# EAGLE design pcb_throughhole (EAGLE 9.6.2)
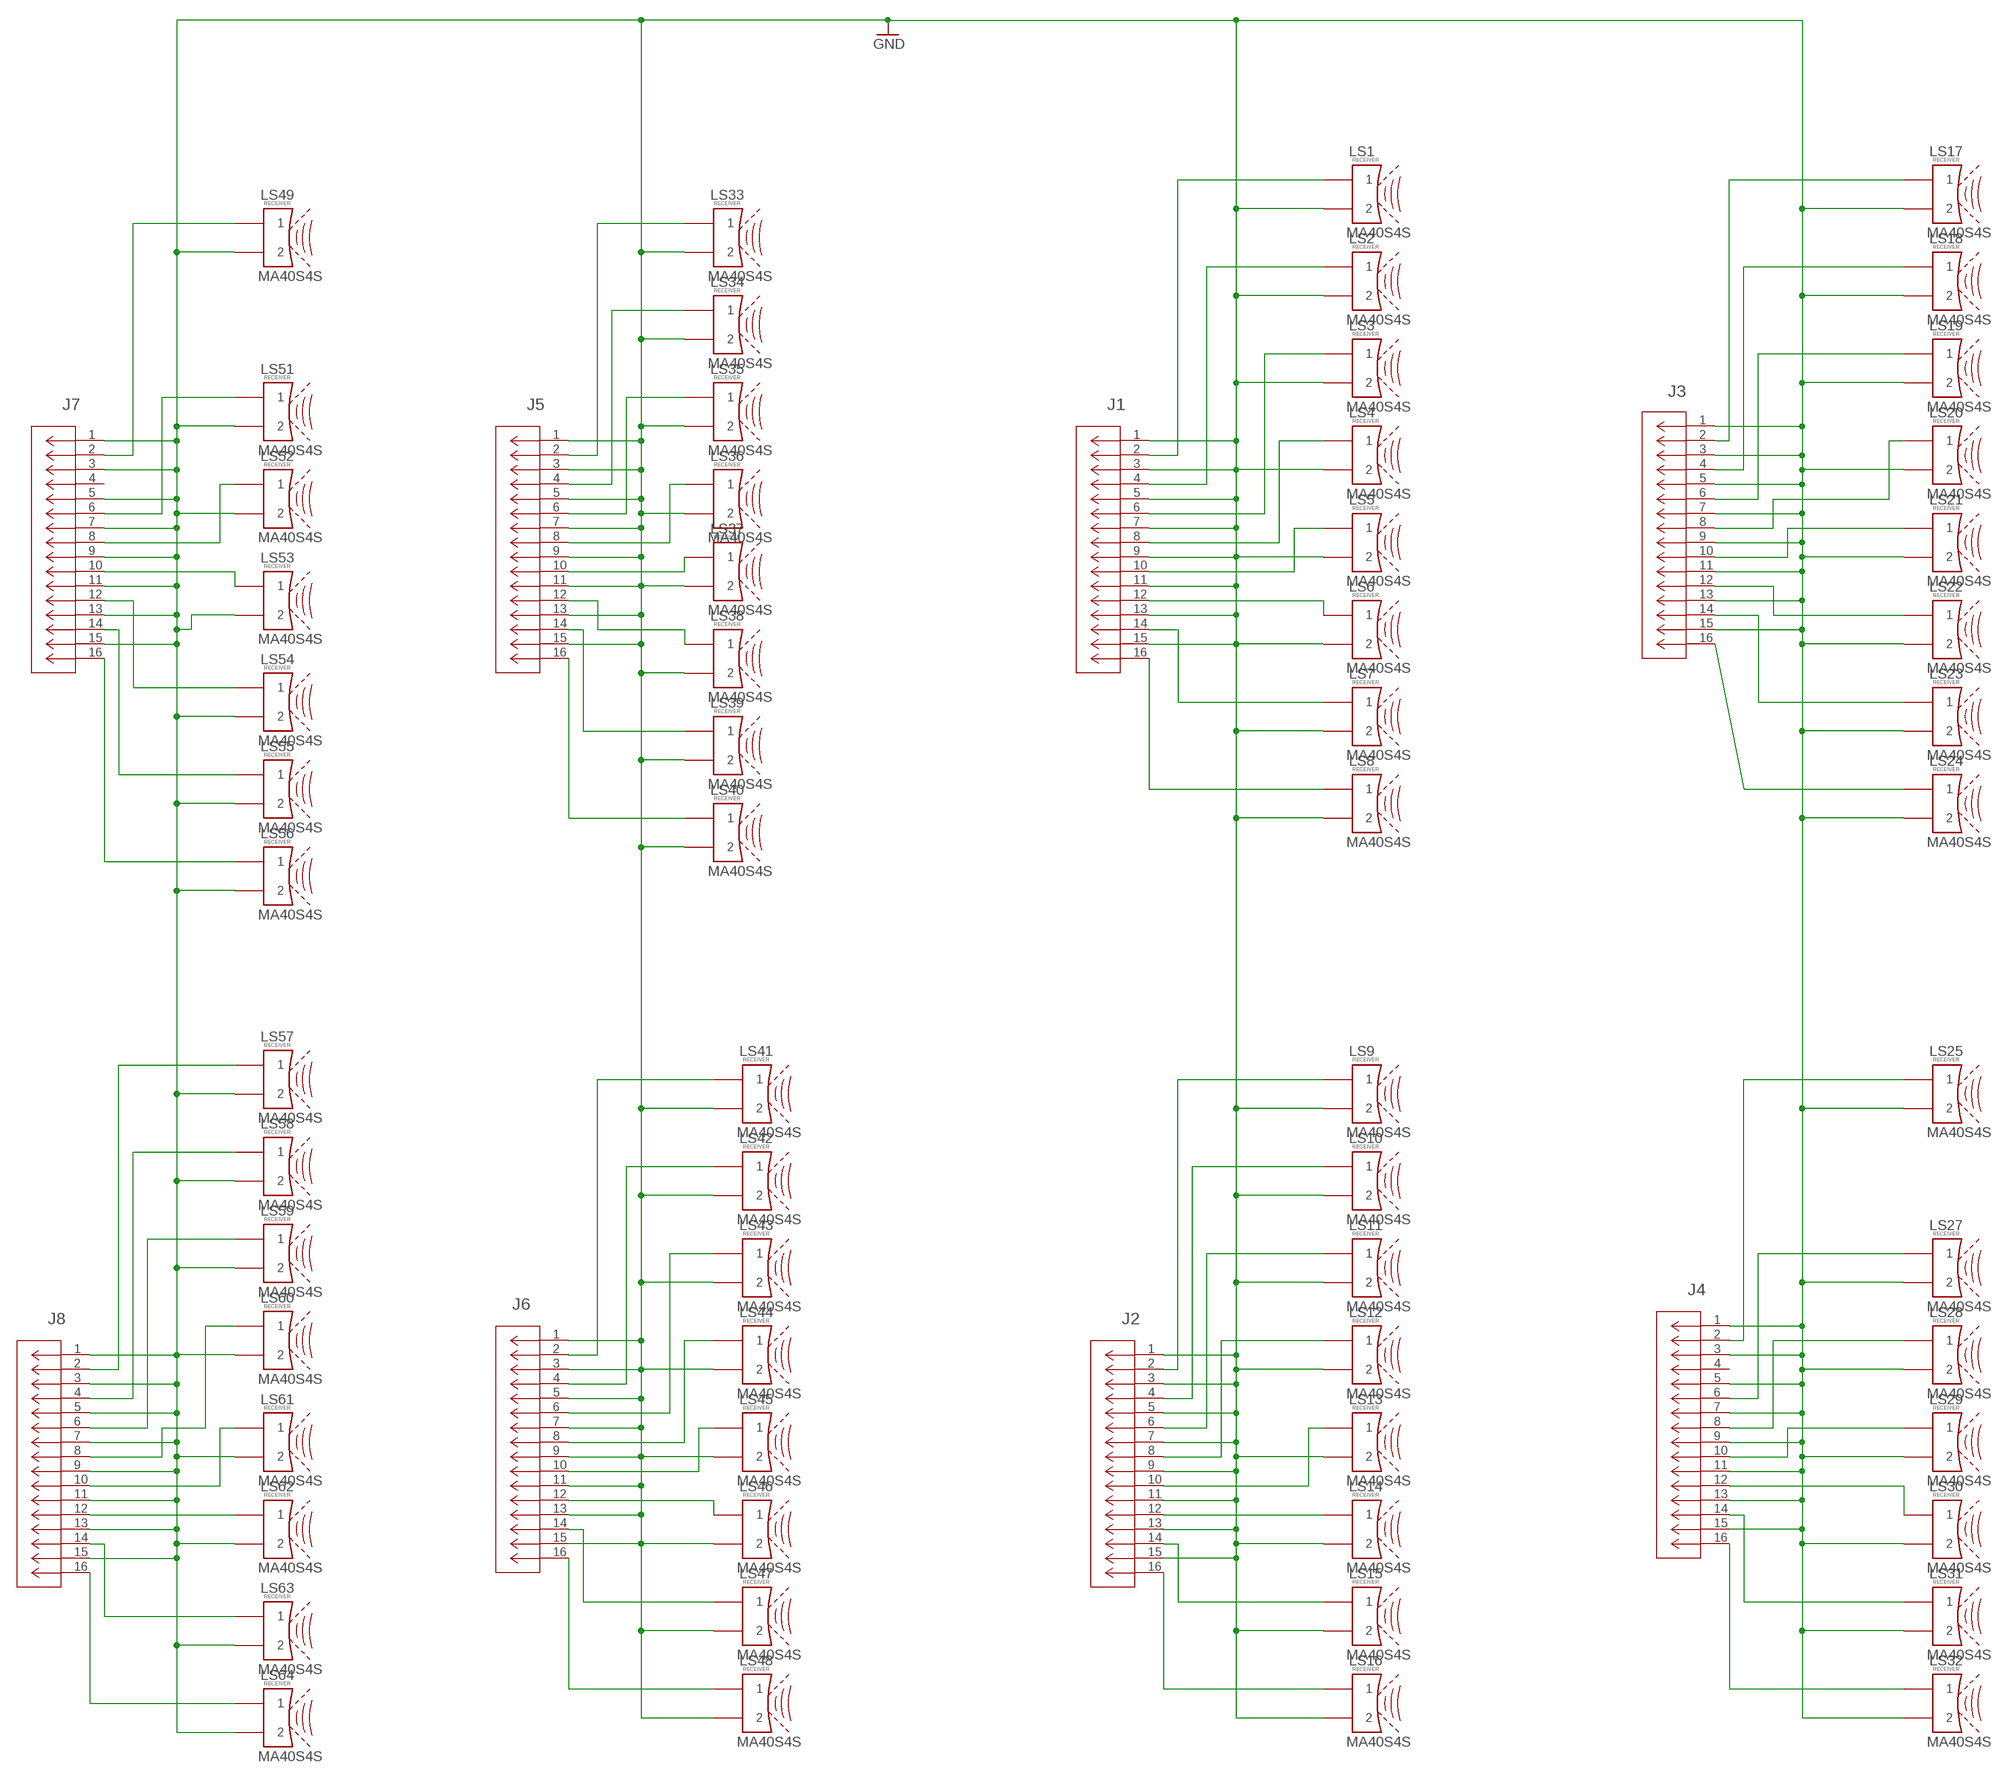
[diagram p0: schematic, sheet 1]

## Parts
J1  70246-1201  [CONN_70246-1201_MOL]
J2  70246-1201  [CONN_70246-1201_MOL]
J3  70246-1201  [CONN_70246-1201_MOL]
J4  70246-1201  [CONN_70246-1201_MOL]
J5  70246-1201  [CONN_70246-1201_MOL]
J6  70246-1201  [CONN_70246-1201_MOL]
J7  70246-1201  [CONN_70246-1201_MOL]
J8  70246-1201  [CONN_70246-1201_MOL]
LS1  MA40S4S  [XDCR_MA40S4S]
LS2  MA40S4S  [XDCR_MA40S4S]
LS3  MA40S4S  [XDCR_MA40S4S]
LS4  MA40S4S  [XDCR_MA40S4S]
LS5  MA40S4S  [XDCR_MA40S4S]
LS6  MA40S4S  [XDCR_MA40S4S]
LS7  MA40S4S  [XDCR_MA40S4S]
LS8  MA40S4S  [XDCR_MA40S4S]
LS9  MA40S4S  [XDCR_MA40S4S]
LS10  MA40S4S  [XDCR_MA40S4S]
LS11  MA40S4S  [XDCR_MA40S4S]
LS12  MA40S4S  [XDCR_MA40S4S]
LS13  MA40S4S  [XDCR_MA40S4S]
LS14  MA40S4S  [XDCR_MA40S4S]
LS15  MA40S4S  [XDCR_MA40S4S]
LS16  MA40S4S  [XDCR_MA40S4S]
LS17  MA40S4S  [XDCR_MA40S4S]
LS18  MA40S4S  [XDCR_MA40S4S]
LS19  MA40S4S  [XDCR_MA40S4S]
LS20  MA40S4S  [XDCR_MA40S4S]
LS21  MA40S4S  [XDCR_MA40S4S]
LS22  MA40S4S  [XDCR_MA40S4S]
LS23  MA40S4S  [XDCR_MA40S4S]
LS24  MA40S4S  [XDCR_MA40S4S]
LS25  MA40S4S  [XDCR_MA40S4S]
LS27  MA40S4S  [XDCR_MA40S4S]
LS28  MA40S4S  [XDCR_MA40S4S]
LS29  MA40S4S  [XDCR_MA40S4S]
LS30  MA40S4S  [XDCR_MA40S4S]
LS31  MA40S4S  [XDCR_MA40S4S]
LS32  MA40S4S  [XDCR_MA40S4S]
LS33  MA40S4S  [XDCR_MA40S4S]
LS34  MA40S4S  [XDCR_MA40S4S]
LS35  MA40S4S  [XDCR_MA40S4S]
LS36  MA40S4S  [XDCR_MA40S4S]
LS37  MA40S4S  [XDCR_MA40S4S]
LS38  MA40S4S  [XDCR_MA40S4S]
LS39  MA40S4S  [XDCR_MA40S4S]
LS40  MA40S4S  [XDCR_MA40S4S]
LS41  MA40S4S  [XDCR_MA40S4S]
LS42  MA40S4S  [XDCR_MA40S4S]
LS43  MA40S4S  [XDCR_MA40S4S]
LS44  MA40S4S  [XDCR_MA40S4S]
LS45  MA40S4S  [XDCR_MA40S4S]
LS46  MA40S4S  [XDCR_MA40S4S]
LS47  MA40S4S  [XDCR_MA40S4S]
LS48  MA40S4S  [XDCR_MA40S4S]
LS49  MA40S4S  [XDCR_MA40S4S]
LS51  MA40S4S  [XDCR_MA40S4S]
LS52  MA40S4S  [XDCR_MA40S4S]
LS53  MA40S4S  [XDCR_MA40S4S]
LS54  MA40S4S  [XDCR_MA40S4S]
LS55  MA40S4S  [XDCR_MA40S4S]
LS56  MA40S4S  [XDCR_MA40S4S]
LS57  MA40S4S  [XDCR_MA40S4S]
LS58  MA40S4S  [XDCR_MA40S4S]
LS59  MA40S4S  [XDCR_MA40S4S]
LS60  MA40S4S  [XDCR_MA40S4S]
LS61  MA40S4S  [XDCR_MA40S4S]
LS62  MA40S4S  [XDCR_MA40S4S]
LS63  MA40S4S  [XDCR_MA40S4S]
LS64  MA40S4S  [XDCR_MA40S4S]

## Nets
GND: J1.1 J1.3 J1.5 J1.7 J1.9 J1.11 J1.13 J1.15 J2.1 J2.3 J2.5 J2.7 J2.9 J2.11 J2.13 J2.15 J3.1 J3.3 J3.5 J3.7 J3.9 J3.11 J3.13 J3.15 J4.1 J4.3 J4.5 J4.7 J4.9 J4.11 J4.13 J4.15 J5.1 J5.3 J5.5 J5.7 J5.9 J5.11 J5.13 J5.15 J6.1 J6.3 J6.5 J6.7 J6.9 J6.11 J6.13 J6.15 J7.1 J7.3 J7.5 J7.7 J7.9 J7.11 J7.13 J7.15 J8.1 J8.3 J8.5 J8.7 J8.9 J8.11 J8.13 J8.15 LS1.2 LS2.2 LS3.2 LS4.2 LS5.2 LS6.2 LS7.2 LS8.2 LS9.2 LS10.2 LS11.2 LS12.2 LS13.2 LS14.2 LS15.2 LS16.2 LS17.2 LS18.2 LS19.2 LS20.2 LS21.2 LS22.2 LS23.2 LS24.2 LS25.2 LS27.2 LS28.2 LS29.2 LS30.2 LS31.2 LS32.2 LS33.2 LS34.2 LS35.2 LS36.2 LS37.2 LS38.2 LS39.2 LS40.2 LS41.2 LS42.2 LS43.2 LS44.2 LS45.2 LS46.2 LS47.2 LS48.2 LS49.2 LS51.2 LS52.2 LS53.2 LS54.2 LS55.2 LS56.2 LS57.2 LS58.2 LS59.2 LS60.2 LS61.2 LS62.2 LS63.2 LS64.2
N$1: J1.16 LS8.1
N$2: J1.14 LS7.1
N$3: J1.12 LS6.1
N$5: J1.10 LS5.1
N$6: J1.8 LS4.1
N$7: J1.6 LS3.1
N$8: J1.4 LS2.1
N$9: J1.2 LS1.1
N$10: J2.16 LS16.1
N$11: J2.14 LS15.1
N$12: J2.12 LS14.1
N$13: J2.10 LS13.1
N$14: J2.8 LS12.1
N$15: J2.6 LS11.1
N$16: J2.4 LS10.1
N$17: J2.2 LS9.1
N$18: J4.16 LS32.1
N$19: J4.14 LS31.1
N$20: J4.12 LS30.1
N$21: J4.10 LS29.1
N$22: J4.8 LS28.1
N$23: J4.6 LS27.1
N$25: J4.2 LS25.1
N$26: J3.16 LS24.1
N$27: J3.14 LS23.1
N$28: J3.12 LS22.1
N$29: J3.10 LS21.1
N$30: J3.8 LS20.1
N$31: J3.6 LS19.1
N$32: J3.4 LS18.1
N$33: J3.2 LS17.1
N$34: J5.16 LS40.1
N$35: J5.14 LS39.1
N$36: J5.12 LS38.1
N$37: J5.10 LS37.1
N$38: J5.8 LS36.1
N$39: J5.6 LS35.1
N$40: J5.4 LS34.1
N$41: J5.2 LS33.1
N$42: J6.16 LS48.1
N$43: J6.14 LS47.1
N$44: J6.12 LS46.1
N$45: J6.10 LS45.1
N$46: J6.8 LS44.1
N$47: J6.6 LS43.1
N$48: J6.4 LS42.1
N$49: J6.2 LS41.1
N$50: J8.16 LS64.1
N$51: J8.14 LS63.1
N$52: J8.12 LS62.1
N$53: J8.10 LS61.1
N$54: J8.8 LS60.1
N$55: J8.6 LS59.1
N$56: J8.4 LS58.1
N$57: J8.2 LS57.1
N$58: J7.16 LS56.1
N$59: J7.14 LS55.1
N$60: J7.12 LS54.1
N$61: J7.10 LS53.1
N$62: J7.8 LS52.1
N$63: J7.6 LS51.1
N$65: J7.2 LS49.1
Unconnected: J4.4 J7.4

## Library data of the parts
J1-J8 = molex_16way:70246-1201; BUILT_BY: EMA_Cory; COPYRIGHT: Copyright (C) 2018 Accelerated Designs. All rights reserved; DATASHEET: https://www.molex.com/pdm_docs/sd/702461602_sd.pdf; MANUFACTURER_PART_NUMBER: 70246-1201; SOURCELIBRARY: Add_to_database_2020-11-05; VENDOR: Molex Connector Corporation
LS1-LS25 LS27-LS49 LS51-LS64 = MA40S4S:MA40S4S: ULTRASONIC SENSOR RCVR 40KHZ Check availability <https://pricing.snapeda.com/parts/MA40S4S/Murata/view-part?ref=eda>; AVAILABILITY: In Stock; DESCRIPTION: ULTRASONIC SENSOR TRANS 40KHZ; MF: Murata; MP: MA40S4S; PACKAGE: Radial-2 Murata; PRICE: None; PURCHASE-URL: https://pricing.snapeda.com/search/part/MA40S4S/?ref=eda

## Board
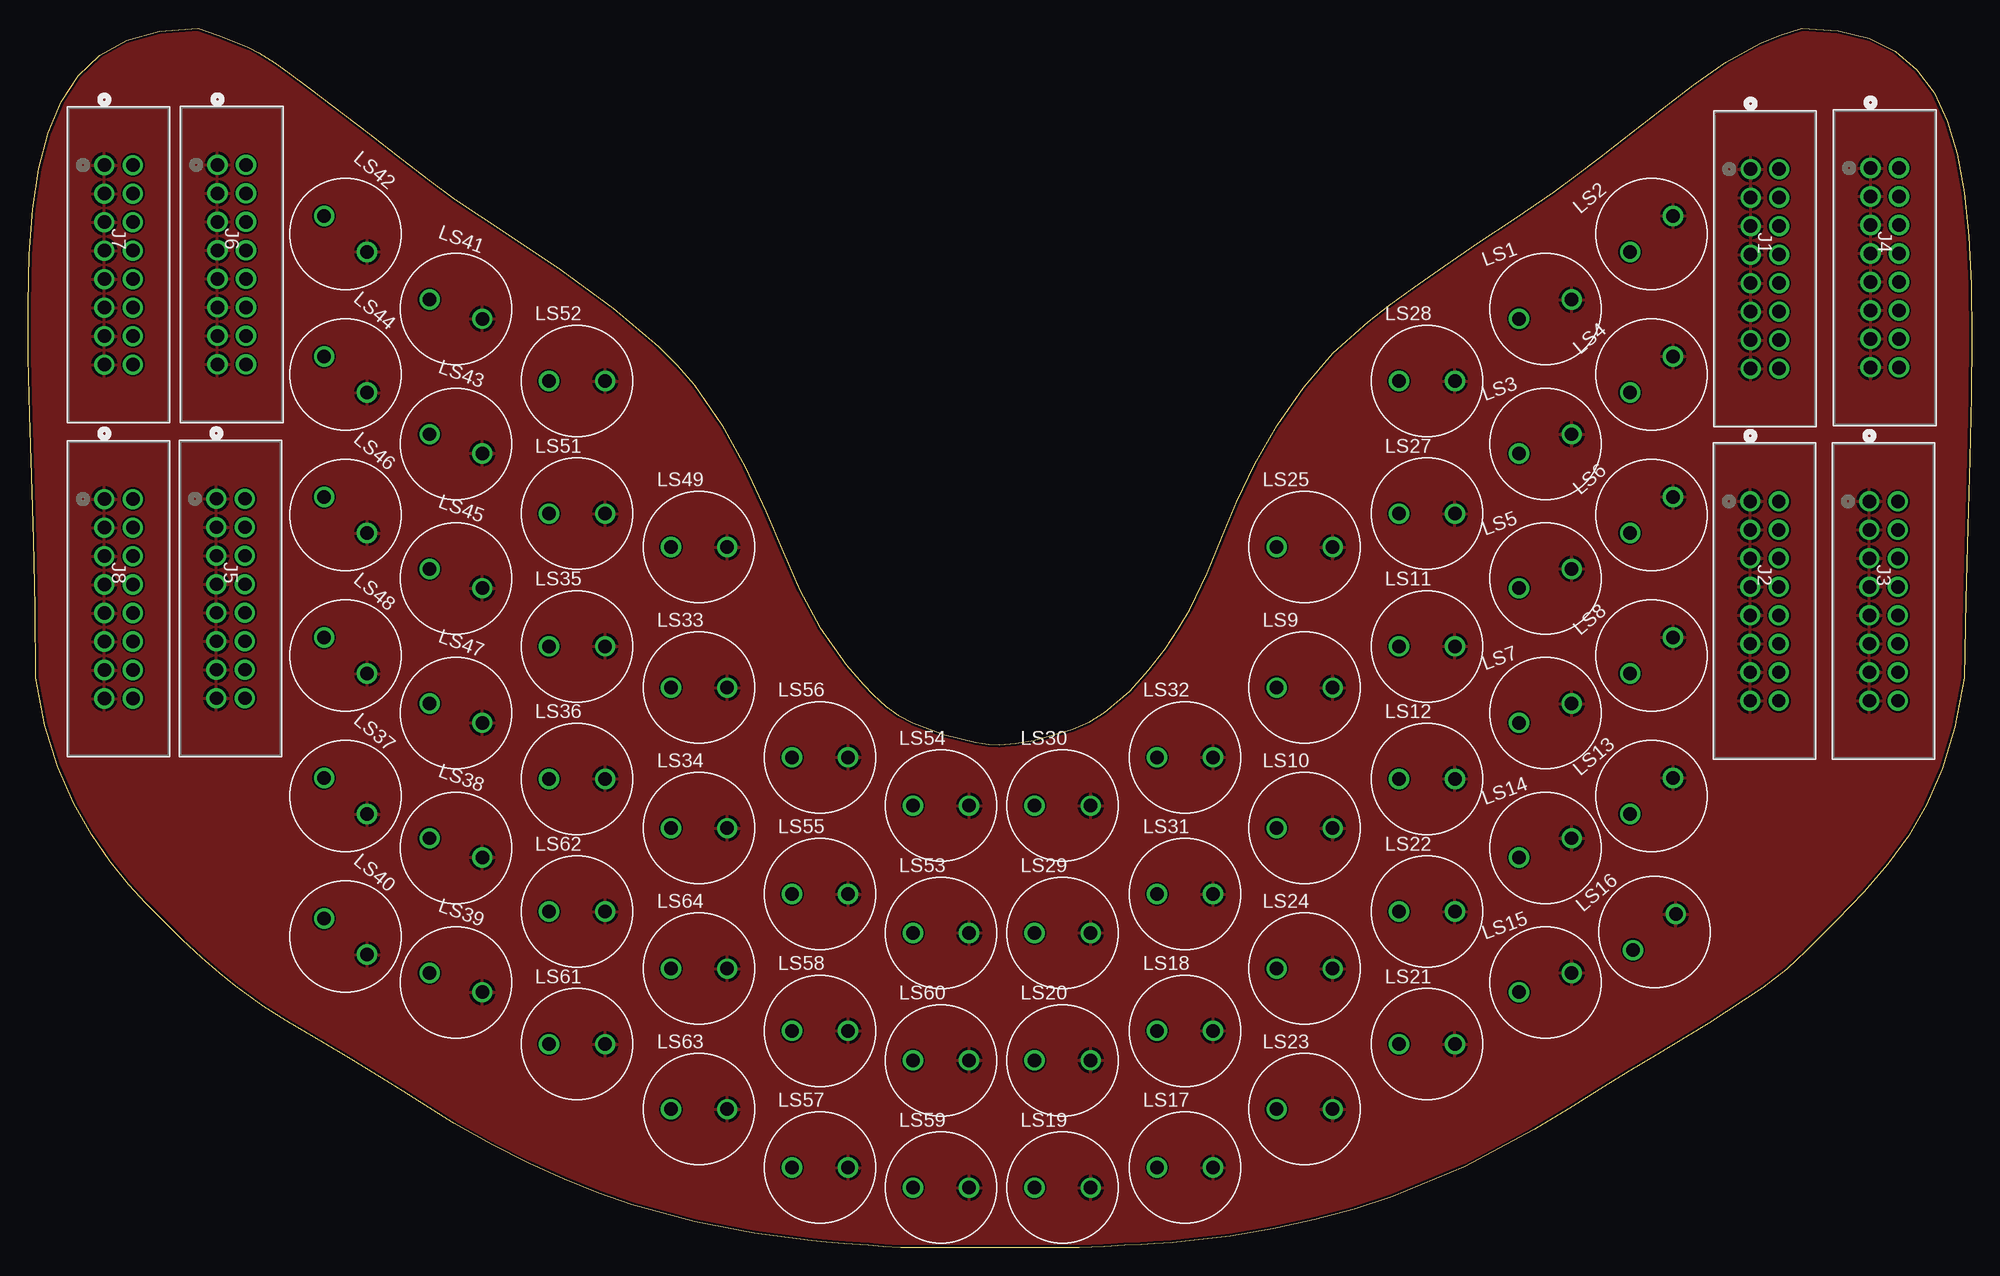
[diagram p1: board, top side]
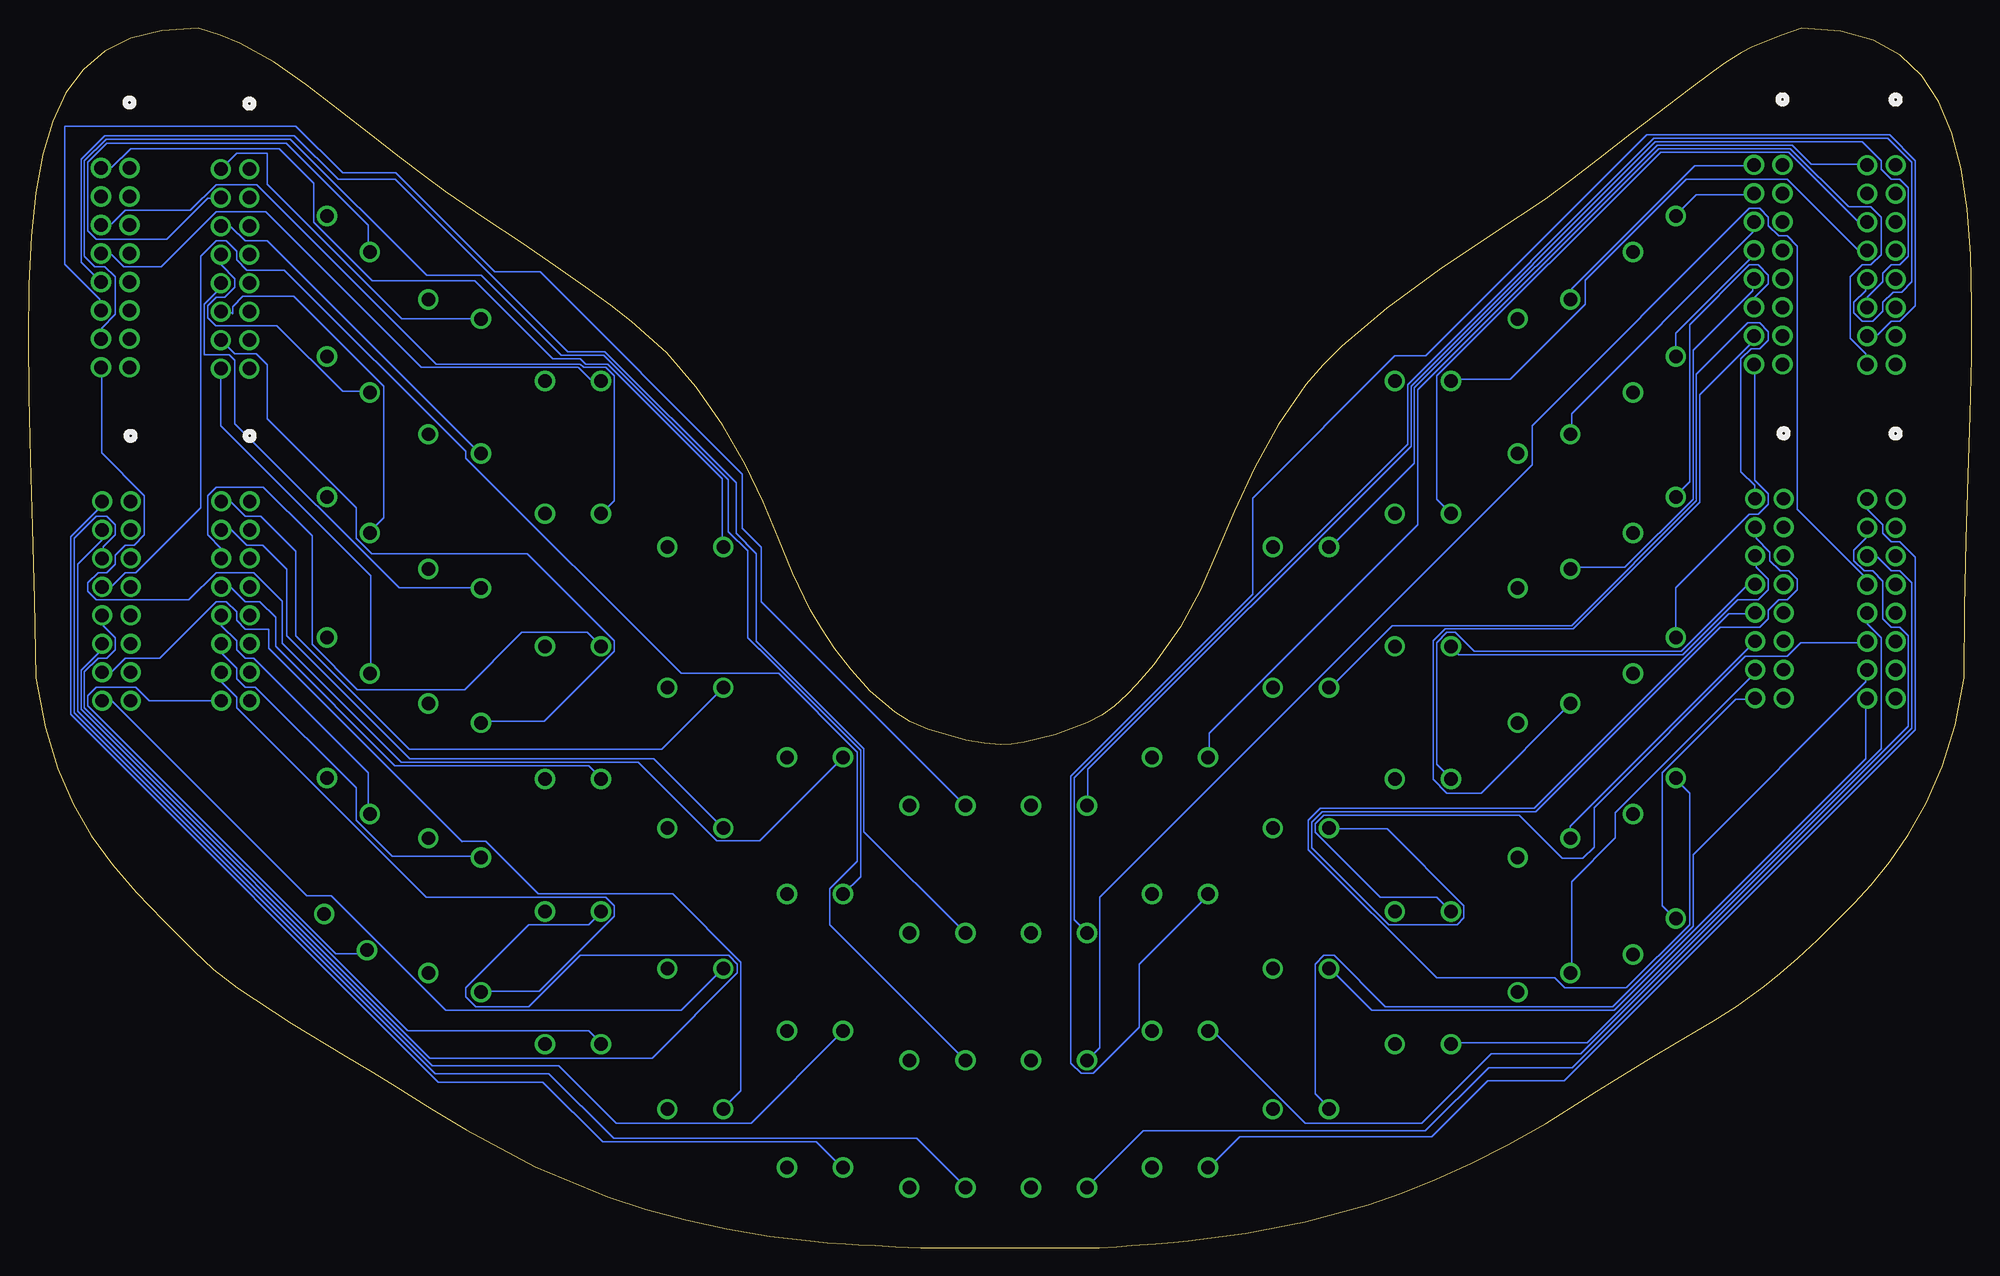
[diagram p2: board, bottom side, seen from below]

Size 173.3 x 108.74 mm. Coordinates in mm from the lower left corner, seen from the top.
Outline: 15.17,108.74 16.97,108.11 18.44,107.54 19.62,107.01 20.57,106.53 22,105.64 23.12,104.83 25.19,103.29 27.09,101.86 30.41,99.3 33.25,97.09 35.75,95.17 38.06,93.47 42.64,90.45 47.51,87.19 52.19,83.75 56.18,80.36 57.89,78.66 59.38,76.94 61.85,73.39 63.93,69.59 65.78,65.67 67.33,62.02 68.82,58.62 70.58,55.33 72.93,51.98 74.45,50.23 75.36,49.3 76.47,48.28 77.58,47.49 78.87,46.8 81.73,45.72 84.49,45.07 85.66,44.9 86.6,44.85 88.06,44.96 89.7,45.24 93.09,46.22 94.64,46.91 96,47.73 98.2,49.6 99.93,51.55 101.36,53.4 102.56,55.18 103.55,56.88 105.11,60.14 106.41,63.31 107.76,66.51 109.37,69.84 111.36,73.31 113.71,76.71 116.37,79.8 119.46,82.57 121.35,84.02 123.6,85.65 126.26,87.53 129.28,89.6 132.54,91.75 136.06,94.14 138,95.56 140.14,97.21 142.64,99.16 145.6,101.46 148.52,103.69 151.36,105.68 154.45,107.37 156.19,108.1 158.11,108.74 161.38,108.51 164.15,107.82 166.48,106.66 168.39,105.05 169.92,102.98 171.12,100.45 172.01,97.48 172.63,94.06 173.03,90.19 173.24,85.87 173.3,81.12 173.25,75.92 173.11,70.29 172.94,64.23 172.77,57.73 172.63,50.8 171.75,46.42 170.63,42.72 169.28,39.54 167.68,36.75 165.81,34.19 163.67,31.72 161.24,29.2 158.51,26.48 156.77,24.84 154.67,23.2 149.83,20.01 144.96,17.09 142.79,15.78 140.82,14.56 137.34,12.4 134.22,10.51 128.07,7.25 121.61,4.57 118.21,3.45 114.69,2.5 111.02,1.69 107.19,1.05 103.18,0.57 102.06,0.47 100.41,0.36 99.25,0.29 97.79,0.21 95.95,0.11 93.7,0 77.82,0 76.25,0.11 74.91,0.21 72.77,0.37 71.17,0.51 69.85,0.64 64.76,1.28 59.44,2.3 53.82,3.85 50.87,4.88 47.82,6.1 44.66,7.53 41.38,9.2 37.97,11.12 34.42,13.31 33.45,13.94 32.28,14.68 30.79,15.61 28.83,16.8 26.28,18.32 24.74,19.22 23,20.24 20.96,21.53 18.51,23.33 17.08,24.49 15.5,25.86 13.75,27.48 11.82,29.37 10.49,30.71 8.96,32.38 7.32,34.41 5.66,36.81 4.08,39.62 2.66,42.88 1.5,46.59 0.7,50.8 0.64,57.08 0.5,63.09 0.32,68.82 0.15,74.25 0.02,79.36 0,84.13 0.12,88.54 0.43,92.57 0.97,96.2 1.79,99.41 2.94,102.18 4.46,104.49 6.4,106.32 8.8,107.65 11.7,108.47 15.17,108.74
Copper layers (1*16): Top 0.035mm / dielectric 1.5mm / Bottom 0.035mm
Design rules "default *": minimum track width 6mil, minimum drill 0.35mm, track to track 6mil, track to pad 6mil, pad to pad 6mil, via to via 6mil, smd to smd 6mil, copper to edge 10mil, drill to drill 6mil, minimum pad ring 10mil, minimum via ring 8mil, stop-mask expansion 4mil, vias tented up to drill 0mil, thermal gap 10mil

### Footprints (pad centres in the part's own frame; a part is rotated, then mirrored left to right if it is on the bottom)
CONN_70246-1201_MOL = drill 1.194 pad 1.702: 1 0,0; 2 0,2.54; 3 2.54,0; 4 2.54,2.54; 5 5.08,0; 6 5.08,2.54; 7 7.62,0; 8 7.62,2.54; 9 10.16,0; 10 10.16,2.54; 11 12.7,0; 12 12.7,2.54; 13 15.24,0; 14 15.24,2.54; 15 17.78,0; 16 17.78,2.54
XDCR_MA40S4S = drill 1.2 pad 1.8: 1 -2.5,0; 2 2.5,0

### Placement (x,y rotation side)
J1  153.57,96.16 270 top
J2  153.54,66.55 270 top
J3  164.16,66.55 270 top
J4  164.26,96.27 270 top
J5  16.79,66.78 270 top
J6  16.89,96.55 270 top
J7  6.8,96.52 270 top
J8  6.8,66.75 270 top
LS1  135.27,83.68 20 top
LS2  144.74,90.39 40 top
LS3  135.27,71.67 20 top
LS4  144.74,77.86 40 top
LS5  135.27,59.67 20 top
LS6  144.74,65.33 40 top
LS7  135.27,47.66 20 top
LS8  144.74,52.81 40 top
LS9  113.81,49.94 0 top
LS10  113.81,37.41 0 top
LS11  124.71,53.63 0 top
LS12  124.71,41.8 0 top
LS13  144.74,40.28 40 top
LS14  135.27,35.66 20 top
LS15  135.27,23.65 20 top
LS16  144.99,28.15 40 top
LS17  103.14,7.16 0 top
LS18  103.14,19.35 0 top
LS19  92.23,5.36 0 top
LS20  92.23,16.71 0 top
LS21  124.71,18.15 0 top
LS22  124.71,29.98 0 top
LS23  113.81,12.36 0 top
LS24  113.81,24.89 0 top
LS25  113.81,62.47 0 top
LS27  124.71,65.45 0 top
LS28  124.71,77.28 0 top
LS29  92.23,28.07 0 top
LS30  92.23,39.42 0 top
LS31  103.14,31.54 0 top
LS32  103.14,43.73 0 top
LS33  59.82,49.94 0 top
LS34  59.82,37.41 0 top
LS35  48.95,53.63 0 top
LS36  48.95,41.8 0 top
LS37  28.31,40.28 320 top
LS38  38.15,35.66 340 top
LS39  38.15,23.65 340 top
LS40  28.31,27.75 320 top
LS41  38.15,83.68 340 top
LS42  28.31,90.39 320 top
LS43  38.15,71.67 340 top
LS44  28.31,77.86 320 top
LS45  38.15,59.67 340 top
LS46  28.31,65.33 320 top
LS47  38.15,47.66 340 top
LS48  28.31,52.81 320 top
LS49  59.82,62.47 0 top
LS51  48.95,65.45 0 top
LS52  48.95,77.28 0 top
LS53  81.39,28.07 0 top
LS54  81.39,39.42 0 top
LS55  70.61,31.54 0 top
LS56  70.61,43.73 0 top
LS57  70.61,7.16 0 top
LS58  70.61,19.35 0 top
LS59  81.39,5.36 0 top
LS60  81.39,16.71 0 top
LS61  48.95,18.15 0 top
LS62  48.95,29.98 0 top
LS63  59.82,12.36 0 top
LS64  59.82,24.89 0 top

### Tracks (layer width: path | path; a pad name or v marks a point on that pad's centre or on a via)
GND
  pour Top: -1.98,110.08 -1.98,38.58 42.11,-5.51 127.45,-5.51 131.52,-1.45 133.86,-1.45 181.84,46.53 181.84,103.38 178.48,106.73 170.56,114.66 166.75,114.66 4.98,114.66 -1.02,108.66
N$1
  Bottom 0.152: J1.16 156.11,73.28 142.76,59.93 142.76,51.26 LS8.1
N$2
  Bottom 0.152: J1.14 154.89,79.71 152.96,79.71 151.97,78.72 151.97,73.92 144.04,65.99 144.04,63.25 142.67,61.87 128.8,61.87 121.03,54.1 121.03,53.19 127.28,46.94 132.92,46.94 LS7.1
N$3
  Bottom 0.152: J1.12 156.08,83.36 155.17,83.36 155.07,83.27 155.07,83.92 154.16,84.83 149.62,84.83 141.6,76.81 141.6,65.08 142.82,63.86 LS6.1
N$5
  Bottom 0.152: J1.10 156.23,85.95 156.23,85.5 157.6,84.12 157.6,79.64 155.37,79.64 154.86,79.13 154.86,73.46 140.23,58.83 133.07,58.83 LS5.1
N$6
  Bottom 0.152: J1.8 156.08,88.54 156.08,87.63 154.86,86.41 154.86,85.65 155.78,84.73 156.54,84.73 157.3,83.97 157.3,82.94 156.57,82.2 151.11,82.2 145.26,76.35 142.97,76.35 LS4.1
N$7
  Bottom 0.152: J1.6 156.08,90.98 155.17,90.98 153.95,89.76 151.97,89.76 133.07,70.87 LS3.1
N$8
  Bottom 0.152: J1.4 156.23,93.57 157.3,93.57 160.96,89.92 167.21,89.92 167.97,90.68 167.97,96.77 166.29,98.45 150.28,98.45 142.97,91.15 142.97,88.85 LS2.1
N$9
  Bottom 0.152: J1.2 154.68,97.59 152.01,97.59 151.97,97.55 151.97,94.82 139.97,82.83 LS1.1
N$10
  Bottom 0.152: J2.16 162.48,48.77 163.7,49.99 167.21,49.99 167.97,49.23 167.97,48.31 145.87,26.21 143.79,26.21 LS16.1
N$11
  Bottom 0.152: J2.14 156.08,50.44 154.71,49.07 154.71,48.16 137.79,31.24 121.79,31.24 121.03,30.48 121.03,29.57 127.73,22.86 132.92,22.86 LS15.1
N$12
  Bottom 0.152: J2.12 156.08,53.03 154.71,51.66 154.71,50.75 153.95,49.99 153.03,49.99 144.04,41 144.04,38.1 140.84,34.9 133.07,34.9 LS14.1
N$13
  Bottom 0.152: J2.10 156.08,55.47 154.71,54.1 154.71,53.34 153.95,52.58 153.18,52.58 142.97,42.37 142.97,38.71 LS13.1
N$14
  Bottom 0.152: J2.8 156.08,58.83 155.17,58.83 153.95,57.61 152.65,57.61 151.24,56.2 151.24,53.62 140.59,42.98 123.31,42.98 122.25,41.91 LS12.1
N$15
  Bottom 0.152: J2.6 156.08,62.33 157.3,63.55 157.3,67.06 156.54,67.82 152.32,67.82 147.98,63.48 147.98,53.8 143.96,49.77 134.36,49.77 129.27,54.86 123.47,54.86 122.25,53.65 LS11.1
N$16
  Bottom 0.152: J2.4 155.17,64.01 153.79,62.64 152.4,62.64 150.25,60.49 150.25,54.55 139.29,43.59 117.52,43.59 111.43,37.49 LS10.1
N$17
  Bottom 0.152: J2.2 156.08,66.45 155.17,66.45 153.95,65.23 152.57,65.23 149.46,62.11 149.46,54.58 139.32,44.44 116.82,44.44 111.43,49.84 LS9.1
N$18
  Bottom 0.152: J4.16 166.75,78.49 166.75,70.87 162.94,67.06 162.94,63.55 163.85,62.64 164.61,62.64 165.53,61.72 165.53,60.96 166.29,60.2 167.05,60.2 167.97,59.28 167.97,58.52 167.21,57.76 158.98,57.76 156.54,60.2 153.18,60.2 150.64,57.66 150.64,53.91 140.02,43.28 118.89,43.28 111.88,36.27 108.07,36.27 100.76,43.59 LS32.1
N$19
  Bottom 0.152: J4.14 166.75,81.08 166.75,81.99 165.53,83.21 165.53,86.56 166.44,87.48 167.36,87.48 168.27,88.39 168.27,96.93 166.35,98.85 149.9,98.85 137.75,86.69 132.9,86.69 125.79,79.58 122,79.58 110.87,68.46 110.87,63.84 109.16,62.13 109.16,54.4 108.11,53.35 108.09,53.35 99.08,44.35 99.08,33.07 100.61,31.55 LS31.1
N$20
  Bottom 0.152: J4.12 166.9,83.67 166.9,84.58 170.03,87.71 170.03,100.01 149.42,100.01 145.26,95.85 140.51,95.85 131.68,87.01 127.65,87.01 109.62,68.98 109.62,64.15 107.92,62.45 107.92,57.61 89.79,39.47 LS30.1
N$21
  Bottom 0.152: J4.10 168.58,87.88 168.58,97.05 166.48,99.15 149.56,99.15 145.66,95.25 140.56,95.25 125.2,79.89 121.87,79.89 110.19,68.2 110.19,63.7 108.37,61.88 108.37,54.07 98.78,44.48 98.78,37.11 LS29.1
N$22
  Bottom 0.152: J4.8 166.75,88.54 165.83,88.54 164.77,87.48 161.41,87.48 156.54,92.35 152.1,92.35 138.23,78.49 124.23,78.49 123.16,77.42 122.25,77.42 LS28.1
N$23
  Bottom 0.152: J4.6 166.75,91.29 165.83,91.29 164.61,92.51 158.82,92.51 156.54,94.79 152.91,94.79 136.91,78.79 124.08,78.79 123.77,78.49 121.79,78.49 121.03,77.72 121.03,66.6 122.09,65.53 LS27.1
N$25
  Bottom 0.152: J4.2 166.75,96.32 165.83,96.32 164.15,98 150.93,98 147.85,94.93 147.85,91.44 142.63,86.22 133.46,86.22 126.52,79.28 124.05,79.28 123.57,78.79 121.64,78.79 111.43,68.58 111.43,62.48 LS25.1
N$26
  Bottom 0.152: J3.16 165.83,48.77 148.45,31.39 146.28,31.39 136.08,21.18 115.08,21.18 111.43,24.84 LS24.1
N$27
  Bottom 0.152: J3.14 166.6,51.36 165.83,51.36 164.61,52.58 161.57,52.58 156.54,57.61 155.62,57.61 154.71,56.69 154.71,55.93 153.94,55.16 151.84,55.16 151.84,53.44 134.61,36.2 134.58,36.23 132.51,36.23 127.84,31.55 115.85,31.55 109.75,25.45 109.75,14.02 111.28,12.5 LS23.1
N$28
  Bottom 0.152: J3.12 166.75,53.8 166.75,53.34 168.58,51.51 168.58,48.01 137.49,16.92 117.68,16.92 110.06,24.54 110.06,25.3 110.82,26.06 124.08,26.06 128.65,21.49 133.37,21.49 134.29,22.4 134.29,23.16 128.65,28.8 123.31,28.8 122.25,29.87 LS22.1
N$29
  Bottom 0.152: J3.10 166.6,56.39 166.6,55.47 165.53,54.41 165.53,53.34 166.29,52.58 167.05,52.58 168.27,51.36 168.27,48.16 139.47,19.36 123.31,19.36 122.25,18.29 LS21.1
N$30
  Bottom 0.152: J3.8 166.6,58.98 165.83,58.98 164.61,60.2 163.7,60.2 157.91,65.99 157.91,88.39 156.54,89.76 155.62,89.76 154.71,88.85 154.71,88.09 153.79,87.17 150.44,87.17 134.29,71.02 134.29,70.41 115.08,51.21 106.4,51.21 99.39,44.2 99.39,34.44 101.83,32 101.83,28.8 89.79,16.76 LS20.1
N$31
  Bottom 0.152: J3.6 166.6,61.57 166.6,62.48 165.53,63.55 165.53,64.47 166.29,65.23 167.21,65.23 169.19,63.25 169.19,47.7 137.01,15.53 126.87,15.53 121.09,9.75 94.05,9.75 89.79,5.49 LS19.1
N$32
  Bottom 0.152: J3.4 166.75,64.01 166.75,63.09 168.88,60.96 168.88,47.85 137.27,16.25 126.01,16.25 120.88,11.12 108.84,11.12 100.76,19.2 LS18.1
N$33
  Bottom 0.152: J3.2 166.75,66.45 166.75,66.14 169.49,63.4 169.49,47.55 136.72,14.78 127.41,14.78 122.08,9.45 103.05,9.45 100.76,7.16 LS17.1
N$34
  Bottom 0.152: J5.16 19.38,48.92 21.05,48.92 27.61,42.37 27.61,30.48 26.54,29.41 LS40.1
N$35
  Bottom 0.152: J5.14 19.38,51.51 19.38,51.21 31.8,38.79 31.8,36.54 35.68,32.65 35.68,24.54 LS39.1
N$36
  Bottom 0.152: J5.12 35.8,37.6 LS38.1
N$37
  Bottom 0.152: J5.10 19.38,56.54 21.66,56.54 39.04,39.17 58.09,39.17 59.15,38.1 59.15,35.51 47.72,24.08 37.21,24.08 36.29,23.16 30.81,23.16 25.17,28.8 25.17,40.54 26.39,41.76 LS37.1
N$38
  Bottom 0.152: J5.8 19.38,59.13 19.99,59.13 25.93,53.19 44.37,53.19 46.05,54.86 46.81,54.86 47.72,53.95 47.72,43.13 46.51,41.91 LS36.1
N$39
  Bottom 0.152: J5.6 19.23,61.57 19.23,60.66 18.16,59.59 18.16,58.67 19.07,57.76 20.9,57.76 25.78,52.88 45.74,52.88 46.35,53.49 LS35.1
N$40
  Bottom 0.152: J5.4 19.23,64.16 19.23,63.25 18.01,62.03 18.01,61.27 17.09,60.35 16.33,60.35 15.57,59.59 15.57,58.67 16.48,57.76 17.24,57.76 18.16,56.84 18.16,56.08 18.92,55.32 22.43,55.32 38.88,38.86 57.94,38.86 58.85,37.95 58.85,35.66 51.99,28.8 45.9,28.8 45.29,29.41 45.29,30.48 52.14,37.34 57.17,37.34 LS34.1
N$41
  Bottom 0.152: J5.2 19.38,66.9 19.38,67.97 20.6,69.19 20.6,79.25 19.68,80.16 18.92,80.16 18.16,80.92 18.16,81.69 18.92,82.45 19.99,82.45 24.56,77.88 24.56,66.6 35.68,55.47 51.69,55.47 57.17,49.99 LS33.1
N$42
  Bottom 0.152: J6.16 19.38,78.64 19.38,68.43 18.16,67.21 18.16,66.29 19.07,65.38 19.84,65.38 26.39,58.83 26.39,54.56 LS48.1
N$43
  Bottom 0.152: J6.14 19.53,81.23 19.53,80.77 24.25,76.05 24.25,66.45 35.53,55.17 46.96,55.17 48.03,54.1 48.03,41.76 46.81,40.54 43.76,40.54 35.84,48.46 LS47.1
N$44
  Bottom 0.152: J6.12 19.38,83.97 19.38,84.73 18.16,85.95 18.16,86.72 19.07,87.63 19.84,87.63 25.17,82.3 25.17,68.28 26.39,67.06 LS46.1
N$45
  Bottom 0.152: J6.10 19.53,86.26 19.53,85.34 24.86,80.01 24.86,66.75 30.96,60.66 35.68,60.66 LS45.1
N$46
  Bottom 0.152: J6.8 19.53,88.85 19.53,88.39 26.39,81.53 26.39,79.55 LS44.1
N$47
  Bottom 0.152: J6.6 19.53,91.44 19.53,90.53 35.68,74.37 35.68,72.54 LS43.1
N$48
  Bottom 0.152: J6.4 19.53,93.88 24.56,93.88 26.39,92.05 LS42.1
N$49
  Bottom 0.152: J6.2 19.53,96.47 24.71,96.47 35.68,85.5 35.68,84.58 LS41.1
N$50
  Bottom 0.152: J8.16 9.47,48.92 9.47,43.59 31.87,21.18 53.52,21.18 57.17,24.84 LS64.1
N$51
  Bottom 0.152: J8.14 9.47,51.51 9.47,50.44 24.86,35.05 24.86,28.65 32.03,21.49 52.3,21.49 56.87,26.06 57.78,26.06 58.54,25.3 58.54,13.72 57.33,12.5 LS63.1
N$52
  Bottom 0.152: J8.12 9.47,53.95 15.26,53.95 16.48,52.73 20.22,52.73 33.7,39.25 33.7,35.71 34.68,34.72 36.51,34.72 40.35,38.56 57.78,38.56 58.54,37.8 58.54,37.03 52.75,31.24 47.72,31.24 46.51,30.02 LS62.1
N$53
  Bottom 0.152: J8.10 9.32,56.54 9.32,55.63 8.1,54.41 8.1,44.5 34.31,18.29 46.35,18.29 LS61.1
N$54
  Bottom 0.152: J8.8 9.47,59.13 9.47,59.74 15.57,65.84 15.57,89.31 16.48,90.22 17.24,90.22 18.16,91.14 18.16,91.9 18.92,92.66 19.84,92.66 39.19,73.3 39.19,69.8 77.75,31.24 77.75,17.83 78.81,16.76 LS60.1
N$55
  Bottom 0.152: J8.6 9.32,61.57 8.41,61.57 7.19,60.35 6.42,60.35 5.36,59.28 5.36,46.33 35.63,16.05 43.09,16.05 48.72,10.42 73.88,10.42 78.81,5.49 LS59.1
N$56
  Bottom 0.152: J8.4 9.47,64.16 9.47,63.25 10.54,62.18 10.54,61.27 9.62,60.35 8.86,60.35 7.95,59.44 7.95,56.08 7.19,55.32 6.42,55.32 5.66,54.56 5.66,46.48 34.86,17.28 42.88,17.28 49.03,11.12 59.46,11.12 67.54,19.2 67.99,19.2 LS58.1
N$57
  Bottom 0.152: J8.2 9.32,66.75 9.32,65.84 7.95,64.47 7.95,63.7 7.19,62.94 6.42,62.94 5.05,61.57 5.05,46.18 36.34,14.89 43.18,14.89 48.18,9.89 65.26,9.89 67.99,7.16 LS57.1
N$58
  Bottom 0.152: J7.16 9.47,78.79 9.47,79.7 10.84,81.08 10.84,86.56 9.78,87.63 9.01,87.63 8.1,88.54 8.1,91.9 9.01,92.81 11,92.81 16.18,97.99 27.91,97.99 49.4,76.5 49.4,64.47 67.99,45.87 67.99,43.74 LS56.1
N$59
  Bottom 0.152: J7.14 9.32,81.38 8.41,81.38 7.19,82.6 6.42,82.6 5.05,83.97 5.05,96.93 7.34,99.21 28.99,99.21 48.68,79.52 51.45,79.52 64.13,66.84 64.13,58.27 80.34,42.06 80.34,16.46 79.42,15.54 78.36,15.54 74.24,19.66 74.24,25.3 68.15,31.39 LS55.1
N$60
  Bottom 0.152: J7.12 9.32,83.82 9.32,84.73 7.95,86.11 7.95,86.87 7.19,87.63 6.42,87.63 5.66,88.39 5.66,94.49 6.42,95.25 7.19,95.25 8.1,96.16 8.1,96.93 9.78,98.6 28.22,98.6 50.01,76.81 50.01,71.48 78.81,42.67 78.81,39.47 LS54.1
N$61
  Bottom 0.152: J7.10 9.47,86.26 9.47,85.34 10.54,84.28 10.54,83.36 9.78,82.6 8.86,82.6 7.95,83.52 7.95,84.28 7.03,85.19 6.27,85.19 5.36,86.11 5.36,96.77 7.49,98.91 28.37,98.91 50.31,76.96 50.31,71.63 80.03,41.91 80.03,29.26 78.97,28.19 LS53.1
N$62
  Bottom 0.152: J7.8 9.47,89 10.23,89 16.48,95.25 25.47,95.25 34.47,86.26 34.47,84.12 41.17,77.42 46.35,77.42 LS52.1
N$63
  Bottom 0.152: J7.6 10.08,91.44 16.33,97.69 27.76,97.69 47.72,77.72 47.72,66.75 46.51,65.53 LS51.1
N$65
  Bottom 0.152: J7.2 9.47,96.62 14.35,96.62 16.03,98.3 28.06,98.3 49.7,76.66 49.7,69.95 57.17,62.48 LS49.1